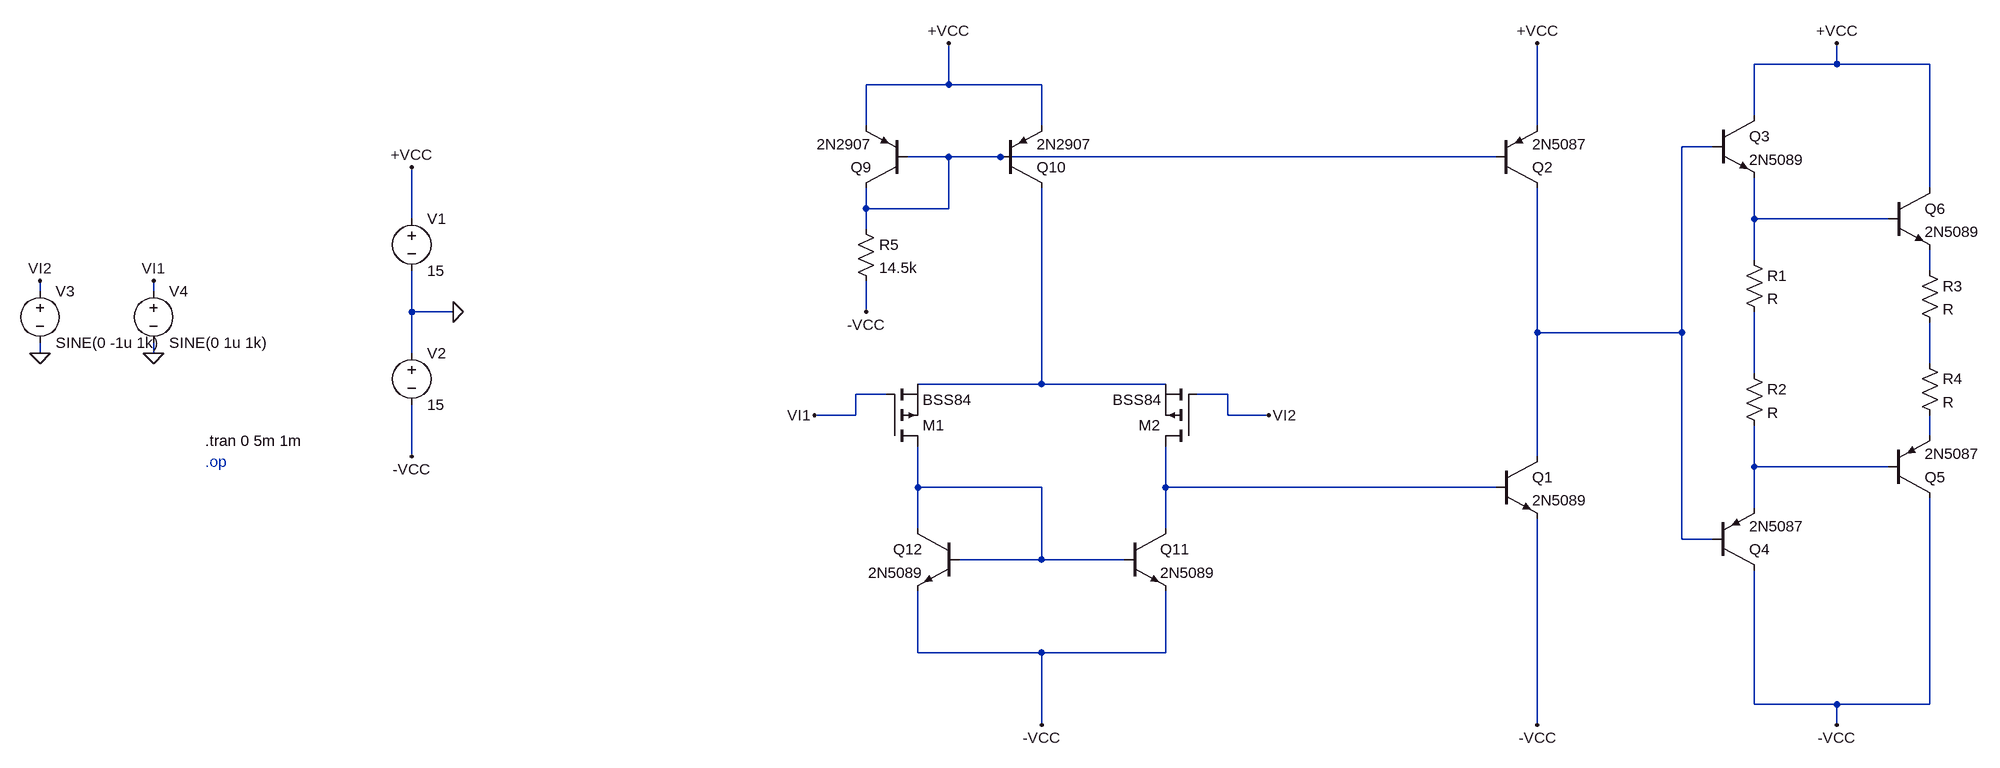
[diagram p0: schematic AmplificadorOperacionalCompleto_v1.asc]
AmplificadorOperacionalCompleto_v1.asc, the LTspice schematic file:
Version 4.1
SHEET 1 4688 1376
WIRE 2240 128 2240 96
WIRE 2240 128 2112 128
WIRE 2384 128 2240 128
WIRE 864 160 864 96
WIRE 864 160 736 160
WIRE 1008 160 864 160
WIRE 2112 208 2112 128
WIRE 736 224 736 160
WIRE 1008 224 1008 160
WIRE 1776 224 1776 96
WIRE 2048 256 2000 256
WIRE 864 272 800 272
WIRE 944 272 864 272
WIRE 1712 272 944 272
WIRE 2384 320 2384 128
WIRE 736 352 736 320
WIRE 864 352 864 272
WIRE 864 352 736 352
WIRE 32 368 32 288
WIRE 2112 368 2112 304
WIRE 2320 368 2112 368
WIRE 736 384 736 352
WIRE 2112 432 2112 368
WIRE 2384 448 2384 416
WIRE -544 480 -544 464
WIRE -368 480 -368 464
WIRE 32 512 32 448
WIRE 96 512 32 512
WIRE 736 512 736 464
WIRE 1776 544 1776 320
WIRE 2000 544 2000 256
WIRE 2000 544 1776 544
WIRE -544 576 -544 560
WIRE -368 576 -368 560
WIRE 32 576 32 512
WIRE 2384 592 2384 528
WIRE 2112 608 2112 512
WIRE 1008 624 1008 320
WIRE 1008 624 816 624
WIRE 1200 624 1008 624
WIRE 768 640 720 640
WIRE 1296 640 1248 640
WIRE 720 672 720 640
WIRE 720 672 656 672
WIRE 1296 672 1296 640
WIRE 1360 672 1296 672
WIRE 2384 704 2384 672
WIRE 32 736 32 656
WIRE 1776 736 1776 544
WIRE 2112 752 2112 688
WIRE 2320 752 2112 752
WIRE 816 784 816 720
WIRE 1008 784 816 784
WIRE 1200 784 1200 720
WIRE 1712 784 1200 784
WIRE 2112 816 2112 752
WIRE 816 848 816 784
WIRE 1200 848 1200 784
WIRE 2000 864 2000 544
WIRE 2048 864 2000 864
WIRE 1008 896 1008 784
WIRE 1008 896 880 896
WIRE 1136 896 1008 896
WIRE 816 1040 816 944
WIRE 1008 1040 816 1040
WIRE 1200 1040 1200 944
WIRE 1200 1040 1008 1040
WIRE 2112 1120 2112 912
WIRE 2240 1120 2112 1120
WIRE 2384 1120 2384 800
WIRE 2384 1120 2240 1120
WIRE 1008 1152 1008 1040
WIRE 1776 1152 1776 832
WIRE 2240 1152 2240 1120
FLAG 32 288 +VCC
FLAG 32 736 -VCC
FLAG -368 464 VI1
FLAG -544 464 VI2
FLAG -368 576 0
FLAG -544 576 0
FLAG 96 512 0
FLAG 736 512 -VCC
FLAG 864 96 +VCC
FLAG 1008 1152 -VCC
FLAG 1360 672 VI2
FLAG 656 672 VI1
FLAG 1776 1152 -VCC
FLAG 1776 96 +VCC
FLAG 2240 1152 -VCC
FLAG 2240 96 +VCC
SYMBOL voltage 32 352 R0
WINDOW 123 0 0 Left 0
WINDOW 39 0 0 Left 0
SYMATTR InstName V1
SYMATTR Value 15
SYMBOL voltage 32 560 R0
WINDOW 123 0 0 Left 0
WINDOW 39 0 0 Left 0
SYMATTR InstName V2
SYMATTR Value 15
SYMBOL voltage -544 464 R0
WINDOW 123 0 0 Left 0
WINDOW 39 0 0 Left 0
SYMATTR InstName V3
SYMATTR Value SINE(0 -1u 1k)
SYMBOL voltage -368 464 R0
WINDOW 123 0 0 Left 0
WINDOW 39 0 0 Left 0
SYMATTR InstName V4
SYMATTR Value SINE(0 1u 1k)
SYMBOL res 720 368 R0
SYMATTR InstName R5
SYMATTR Value 14.5k
SYMBOL pnp 800 320 R180
SYMATTR InstName Q9
SYMATTR Value 2N2907
SYMBOL pnp 944 320 M180
SYMATTR InstName Q10
SYMATTR Value 2N2907
SYMBOL npn 1136 848 R0
SYMATTR InstName Q11
SYMATTR Value 2N5089
SYMBOL npn 880 848 M0
SYMATTR InstName Q12
SYMATTR Value 2N5089
SYMBOL npn 1712 736 R0
SYMATTR InstName Q1
SYMATTR Value 2N5089
SYMBOL pnp 1712 320 M180
SYMATTR InstName Q2
SYMATTR Value 2N5087
SYMBOL pmos 768 720 M180
SYMATTR InstName M1
SYMATTR Value BSS84
SYMBOL pmos 1248 720 R180
SYMATTR InstName M2
SYMATTR Value BSS84
SYMBOL npn 2048 208 R0
SYMATTR InstName Q3
SYMATTR Value 2N5089
SYMBOL res 2096 416 R0
SYMATTR InstName R1
SYMBOL res 2096 592 R0
SYMATTR InstName R2
SYMBOL pnp 2048 912 M180
SYMATTR InstName Q4
SYMATTR Value 2N5087
SYMBOL pnp 2320 800 M180
SYMATTR InstName Q5
SYMATTR Value 2N5087
SYMBOL npn 2320 320 R0
SYMATTR InstName Q6
SYMATTR Value 2N5089
SYMBOL res 2368 432 R0
SYMATTR InstName R3
SYMBOL res 2368 576 R0
SYMATTR InstName R4
TEXT -288 712 Left 2 !.tran 0 5m 1m
TEXT -288 744 Left 2 ;.op

The netlist it stands for:
* AmplificadorOperacionalCompleto_v1.asc
V1 +VCC 0 15
V2 0 -VCC 15
V3 VI2 0 SINE(0 -1u 1k)
V4 VI1 0 SINE(0 1u 1k)
R5 N002 -VCC 14.5k
Q9 N002 N002 +VCC 0 2N2907
Q10 N007 N002 +VCC 0 2N2907
Q11 N011 N010 -VCC 0 2N5089
Q12 N010 N010 -VCC 0 2N5089
Q1 N001 N011 -VCC 0 2N5089
Q2 N001 N002 +VCC 0 2N5087
M1 N010 VI1 N007 N007 BSS84
M2 N011 VI2 N007 N007 BSS84
Q3 +VCC N001 N003 0 2N5089
R1 N003 N006 R
R2 N006 N009 R
Q4 -VCC N001 N009 0 2N5087
Q5 -VCC N009 N008 0 2N5087
Q6 +VCC N003 N004 0 2N5089
R3 N004 N005 R
R4 N005 N008 R
.model NPN NPN
.model PNP PNP
.lib standard.bjt
.model NMOS NMOS
.model PMOS PMOS
.lib standard.mos
.tran 0 5m 1m
* .op
.backanno
.end